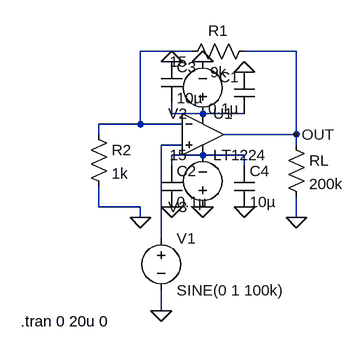
[diagram p0: schematic Draft3.asc]
Draft3.asc, the LTspice schematic file:
Version 4.1
SHEET 1 880 680
WIRE 160 16 80 16
WIRE 320 16 240 16
WIRE 128 112 128 96
WIRE 176 112 128 112
WIRE 240 112 176 112
WIRE 80 128 80 16
WIRE 80 128 16 128
WIRE 144 128 80 128
WIRE 16 144 16 128
WIRE 320 144 320 16
WIRE 320 144 208 144
WIRE 144 160 112 160
WIRE 320 160 320 144
WIRE 176 176 128 176
WIRE 240 176 176 176
WIRE 128 192 128 176
WIRE 240 192 240 176
WIRE 16 256 16 224
WIRE 80 256 16 256
WIRE 80 272 80 256
WIRE 320 272 320 240
WIRE 112 304 112 160
WIRE 112 416 112 384
FLAG 80 272 0
FLAG 112 416 0
FLAG 320 272 0
FLAG 320 144 OUT
FLAG 176 256 0
FLAG 176 32 0
FLAG 240 256 0
FLAG 240 48 0
FLAG 128 32 0
FLAG 128 256 0
SYMBOL OpAmps\\LT1224 176 80 R0
SYMATTR InstName U1
SYMBOL res 256 0 R90
WINDOW 0 0 56 VBottom 2
WINDOW 3 32 56 VTop 2
SYMATTR InstName R1
SYMATTR Value 9k
SYMBOL res 0 128 R0
SYMATTR InstName R2
SYMATTR Value 1k
SYMBOL voltage 112 288 R0
WINDOW 123 24 124 Left 2
WINDOW 39 0 0 Left 0
SYMATTR InstName V1
SYMATTR Value SINE(0 1 100k)
SYMBOL res 304 144 R0
SYMATTR InstName RL
SYMATTR Value 200k
SYMBOL voltage 176 128 R180
WINDOW 123 0 0 Left 0
WINDOW 39 0 0 Left 0
SYMATTR InstName V2
SYMATTR Value 15
SYMBOL voltage 176 272 R180
WINDOW 123 0 0 Left 0
WINDOW 39 0 0 Left 0
SYMATTR InstName V3
SYMATTR Value 15
SYMBOL cap 256 112 R180
WINDOW 0 24 56 Left 2
WINDOW 3 24 8 Left 2
SYMATTR InstName C1
SYMATTR Value 0.1µ
SYMBOL cap 112 192 R0
SYMATTR InstName C2
SYMATTR Value 0.1µ
SYMBOL cap 112 32 R0
SYMATTR InstName C3
SYMATTR Value 10µ
SYMBOL cap 224 192 R0
SYMATTR InstName C4
SYMATTR Value 10µ
TEXT -104 432 Left 2 !.tran 0 20u 0

The netlist it stands for:
* Draft3.asc
X§U1 N003 N001 N002 N004 OUT LT1224  ; pins In+ In- V+ V- OUT
R1 OUT N001 9k
R2 N001 0 1k
V1 N003 0 SINE(0 1 100k)
RL OUT 0 200k
V2 N002 0 15
V3 0 N004 15
C1 N002 0 0.1µ
C2 N004 0 0.1µ
C3 0 N002 10µ
C4 N004 0 10µ
.tran 0 20u 0
.backanno
.end